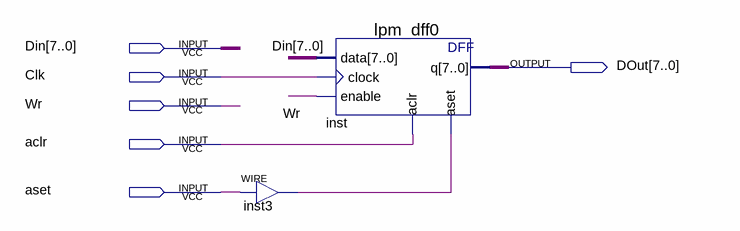
[diagram p0: schematic sheet]
// Quartus schematic test_dff.bdf as structural Verilog: 2 symbols, 6 pins
module test_dff (
  input  [7:0] Din,
  input  Clk,
  input  Wr,
  input  aclr,
  input  aset,
  output [7:0] DOut
);

  wire inst3_out;

  assign inst3_out = aset;  // WIRE inst3
  lpm_dff0 inst (.data(Din), .clock(Clk), .enable(Wr), .aclr(aclr), .aset(inst3_out), .q(DOut));
endmodule
